# EasyEDA Pro project 封装库（F103&407通用）.epro

# Board PCB7
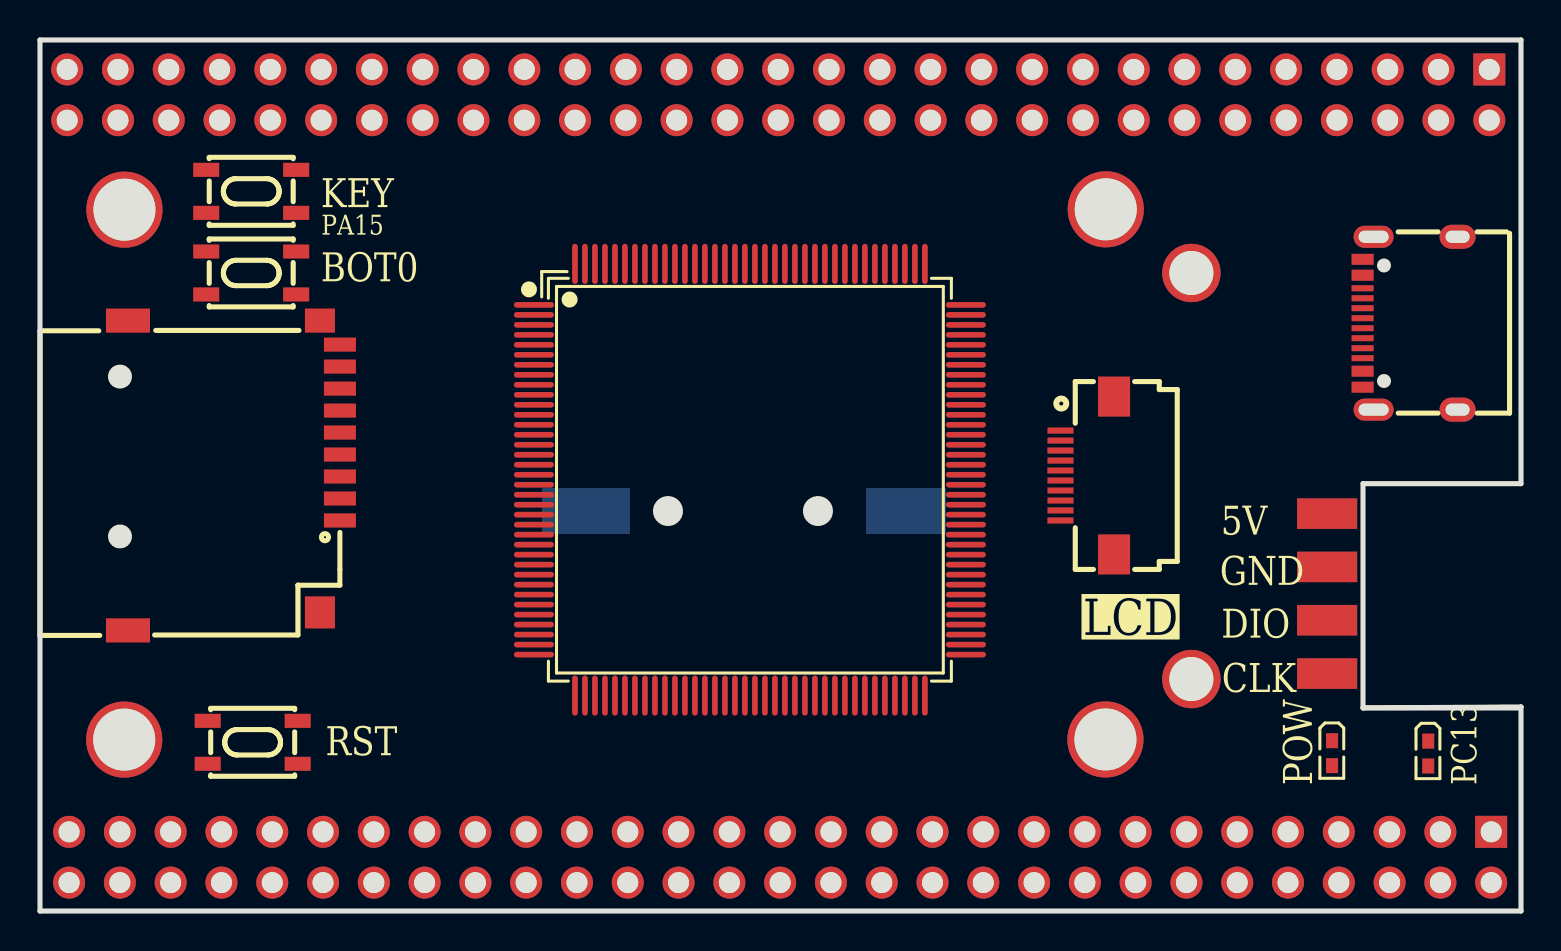
[diagram p0: board, top side]
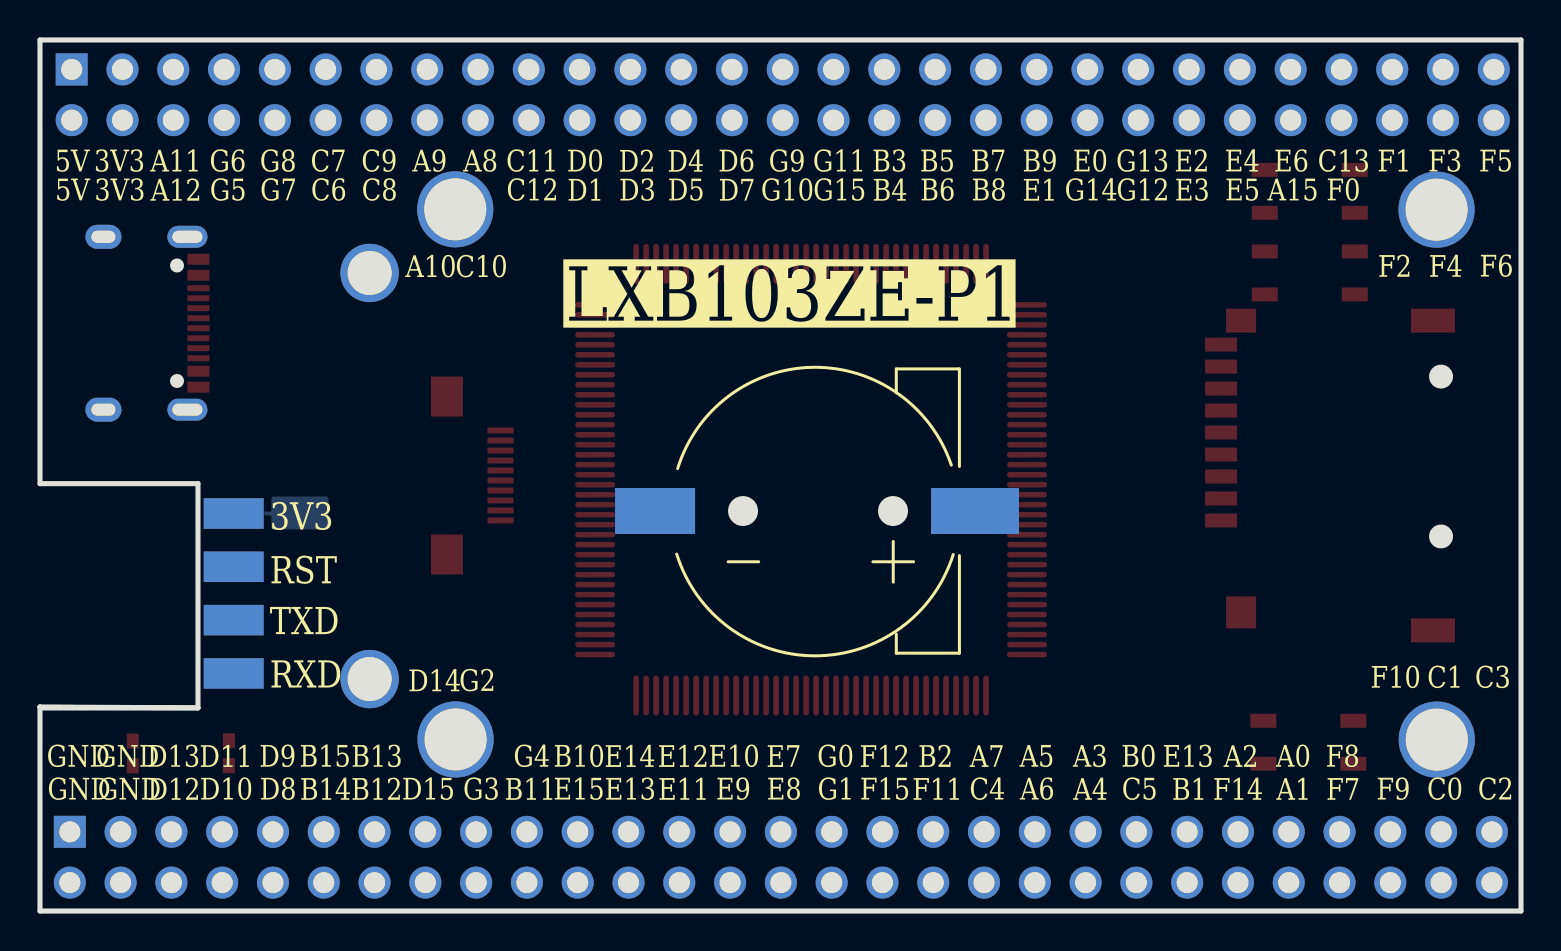
[diagram p1: board, bottom side, seen from below]

Outline 74.07 x 43.59 mm; copper layers: Top Layer, Bottom Layer. Coordinates in mm from the lower left corner of the outline.
Outline path: 66.17,10.16 66.17,21.39 74.07,21.39 74.07,43.59 0,43.59 0,0 74.07,0 74.07,10.21 ; 66.17,10.16 74.02,10.16 74.07,10.21 ; 66.17,10.16 74.07,10.21
Stack: Top Layer 0.035mm / Dielectric1 1.51mm FR4 er 4.5 / Bottom Layer 0.035mm

## Design rules (mm)
template: JLCPCB Capability(Two Layers Board)
spacing copperThickness1oz (default): track to track 0.102, other pairs 0.152 to 0.3
spacing copperThickness2oz: track to track 0.203, other pairs 0.152 to 0.3
track width copperThickness1oz (default): min 0.127, default 0.254, max 2.54
track width copperThickness2oz: min 0.203, default 0.254, max 2.54
differential pair differentialPair (default): width min 0.127, default 0.254, max 2.54; gap min 0.152, default 0.152
via viaSize (default): diameter min 0.5, default 0.61, max 10; hole min 0.3, default 0.305, max 6.3

## Placement (name value [footprint] x y rotation side)
B1  CR1220-2  [BAT-SMD_CR1220-2]  35.31 20.01 0 bottom
CARD1  TF PUSH  [TF-SMD_TF-PUSH]  9.7 21.79 270 top
FPC1  AFC01-S10FCA-00  [FPC-SMD_P0.5-10P_FGS-XJ-H2.0]  52.38 21.79 270 top
H2  X6521WV-2x29H-C60D30  [HDR-TH_58P-P2.54-V-M-R2-C29-S2.54]  37.02 2.69 180 top
H3  X6521WV-2x29H-C60D30  [HDR-TH_58P-P2.54-V-M-R2-C29-S2.54]  36.92 40.84 180 top
LED1  0603-LED-R  [LED0402]  64.62 7.9 270 top
LED2  0603-LED-G  [LED0402]  69.43 7.88 270 top
NOREF  -  [Pad_e2032]  57.58 11.61 0 top
NOREF#2  -  [Pad_e2029]  4.21 8.58 0 top
NOREF#3  -  [Pad_e2033]  57.58 31.93 0 top
NOREF#4  -  [Pad_e2030]  53.3 35.11 0 top
NOREF#5  -  [Pad_e2028]  4.22 35.09 0 top
NOREF#6  -  [Pad_e2031]  53.28 8.58 0 top
SW1  K2-1808SN-A3SW-01  [SW-SMD_4P-L4.2-W3.3-P2.15-LS5.1]  10.56 36.01 180 top
SW2  K2-1808SN-A3SW-01  [SW-SMD_4P-L4.2-W3.3-P2.15-LS5.1]  10.64 8.44 0 top
SW3  K2-1808SN-A3SW-01  [SW-SMD_4P-L4.2-W3.3-P2.15-LS5.1]  10.56 31.93 180 top
U1  STM32F103ZET6  [LQFP-144_L20.0-W20.0-P0.50-LS22.0-BL]  35.5 21.58 270 top
U5  -  [1卧式排针2.54*4P]  64.24 15.82 0 top
U6  -  [1卧式排针2.54*4P]  64.25 15.96 0 bottom
USB1  TYPE-C 16PIN 2MD(073)  [USB-C-SMD_TYPE-C-6PIN-2MD-073]  68.52 29.41 90 top

## Footprints (pads in the part's own frame, mm; a bottom-side part is the same pattern mirrored in y, then rotated)
1卧式排针2.54*4P
  rect 3x1.524 smd: 1(0.127,4.064) 2(0.127,1.397) 3(0.127,-1.27) 4(0.127,-3.937)
BAT-SMD_CR1220-2
  rect 4.4x2.3 smd: 1(-8,0)
  rect 4x2.3 smd: 2(8,0)
FPC-SMD_P0.5-10P_FGS-XJ-H2.0
  rect 0.3x1.3 smd: 1(-2.25,-1.339) 2(-1.75,-1.339) 3(-1.25,-1.34) 4(-0.75,-1.339) 5(-0.25,-1.34) 6(0.25,-1.339) 7(0.75,-1.339) 8(1.25,-1.339) 9(1.75,-1.339) 10(2.25,-1.34)
  rect 2x1.6 smd: 11(3.95,1.34) 12(-3.95,1.34)
HDR-TH_58P-P2.54-V-M-R2-C29-S2.54
  rect 1.6x1.6 hole 1.05: 1(-35.56,-1.27)
  round 1.6 hole 1.05: 2(-35.56,1.27) 3(-33.02,-1.27) 4(-33.02,1.27) 5(-30.48,-1.27) 6(-30.48,1.27) 7(-27.94,-1.27) 8(-27.94,1.27) 9(-25.4,-1.27) 10(-25.4,1.27) 11(-22.86,-1.27) 12(-22.86,1.27) 13(-20.32,-1.27) 14(-20.32,1.27) 15(-17.78,-1.27) 16(-17.78,1.27) 17(-15.24,-1.27) 18(-15.24,1.27) 19(-12.7,-1.27) 20(-12.7,1.27) 21(-10.16,-1.27) 22(-10.16,1.27) 23(-7.62,-1.27) 24(-7.62,1.27) 25(-5.08,-1.27) 26(-5.08,1.27) 27(-2.54,-1.27) 28(-2.54,1.27) 29(0,-1.27) 30(0,1.27) 31(2.54,-1.27) 32(2.54,1.27) 33(5.08,-1.27) 34(5.08,1.27) 35(7.62,-1.27) 36(7.62,1.27) 37(10.16,-1.27) 38(10.16,1.27) 39(12.7,-1.27) 40(12.7,1.27) 41(15.24,-1.27) 42(15.24,1.27) 43(17.78,-1.27) 44(17.78,1.27) 45(20.32,-1.27) 46(20.32,1.27) 47(22.86,-1.27) 48(22.86,1.27) 49(25.4,-1.27) 50(25.4,1.27) 51(27.94,-1.27) 52(27.94,1.27) 53(30.48,-1.27) 54(30.48,1.27) 55(33.02,-1.27) 56(33.02,1.27) 57(35.56,-1.27) 58(35.56,1.27)
LED0402
  rect 0.75x0.6 smd: 1(-0.623,0) 2(0.623,0)
LQFP-144_L20.0-W20.0-P0.50-LS22.0-BL
  oval 0.28x2 smd: 1(-8.75,-10.8) 2(-8.25,-10.8) 3(-7.75,-10.8) 4(-7.25,-10.8) 5(-6.75,-10.8) 6(-6.25,-10.8) 7(-5.75,-10.8) 8(-5.25,-10.8) 9(-4.75,-10.8) 10(-4.25,-10.8) 11(-3.75,-10.8) 12(-3.25,-10.8) 13(-2.75,-10.8) 14(-2.25,-10.8) 15(-1.75,-10.8) 16(-1.25,-10.8) 17(-0.75,-10.8) 18(-0.25,-10.8) 19(0.25,-10.8) 20(0.75,-10.8) 21(1.25,-10.8) 22(1.75,-10.8) 23(2.25,-10.8) 24(2.75,-10.8) 25(3.25,-10.8) 26(3.75,-10.8) 27(4.25,-10.8) 28(4.75,-10.8) 29(5.25,-10.8) 30(5.75,-10.8) 31(6.25,-10.8) 32(6.75,-10.8) 33(7.25,-10.8) 34(7.75,-10.8) 35(8.25,-10.8) 36(8.75,-10.8) 73(8.75,10.8) 74(8.25,10.8) 75(7.75,10.8) 76(7.25,10.8) 77(6.75,10.8) 78(6.25,10.8) 79(5.75,10.8) 80(5.25,10.8) 81(4.75,10.8) 82(4.25,10.8) 83(3.75,10.8) 84(3.25,10.8) 85(2.75,10.8) 86(2.25,10.8) 87(1.75,10.8) 88(1.25,10.8) 89(0.75,10.8) 90(0.25,10.8) 91(-0.25,10.8) 92(-0.75,10.8) 93(-1.25,10.8) 94(-1.75,10.8) 95(-2.25,10.8) 96(-2.75,10.8) 97(-3.25,10.8) 98(-3.75,10.8) 99(-4.25,10.8) 100(-4.75,10.8) 101(-5.25,10.8) 102(-5.75,10.8) 103(-6.25,10.8) 104(-6.75,10.8) 105(-7.25,10.8) 106(-7.75,10.8) 107(-8.25,10.8) 108(-8.75,10.8)
  oval 2x0.28 smd: 37(10.8,-8.75) 38(10.8,-8.25) 39(10.8,-7.75) 40(10.8,-7.25) 41(10.8,-6.75) 42(10.8,-6.25) 43(10.8,-5.75) 44(10.8,-5.25) 45(10.8,-4.75) 46(10.8,-4.25) 47(10.8,-3.75) 48(10.8,-3.25) 49(10.8,-2.75) 50(10.8,-2.25) 51(10.8,-1.75) 52(10.8,-1.25) 53(10.8,-0.75) 54(10.8,-0.25) 55(10.8,0.25) 56(10.8,0.75) 57(10.8,1.25) 58(10.8,1.75) 59(10.8,2.25) 60(10.8,2.75) 61(10.8,3.25) 62(10.8,3.75) 63(10.8,4.25) 64(10.8,4.75) 65(10.8,5.25) 66(10.8,5.75) 67(10.8,6.25) 68(10.8,6.75) 69(10.8,7.25) 70(10.8,7.75) 71(10.8,8.25) 72(10.8,8.75) 109(-10.8,8.75) 110(-10.8,8.25) 111(-10.8,7.75) 112(-10.8,7.25) 113(-10.8,6.75) 114(-10.8,6.25) 115(-10.8,5.75) 116(-10.8,5.25) 117(-10.8,4.75) 118(-10.8,4.25) 119(-10.8,3.75) 120(-10.8,3.25) 121(-10.8,2.75) 122(-10.8,2.25) 123(-10.8,1.75) 124(-10.8,1.25) 125(-10.8,0.75) 126(-10.8,0.25) 127(-10.8,-0.25) 128(-10.8,-0.75) 129(-10.8,-1.25) 130(-10.8,-1.75) 131(-10.8,-2.25) 132(-10.8,-2.75) 133(-10.8,-3.25) 134(-10.8,-3.75) 135(-10.8,-4.25) 136(-10.8,-4.75) 137(-10.8,-5.25) 138(-10.8,-5.75) 139(-10.8,-6.25) 140(-10.8,-6.75) 141(-10.8,-7.25) 142(-10.8,-7.75) 143(-10.8,-8.25) 144(-10.8,-8.75)
Pad_e2028
  round 3.81 hole 3.1: 1(0,0)
Pad_e2029
  round 3.81 hole 3.1: 1(0,0)
Pad_e2030
  round 3.81 hole 3.1: 1(0,0)
Pad_e2031
  round 3.81 hole 3.1: 1(0,0)
Pad_e2032
  round 2.921 hole 2.2: 1(0,0)
Pad_e2033
  round 2.921 hole 2.2: 1(0,0)
SW-SMD_4P-L4.2-W3.3-P2.15-LS5.1
  rect 1.3x0.7 smd: 1(-2.25,1.075) 2(2.25,1.075) 3(-2.25,-1.075) 4(2.25,-1.075)
TF-SMD_TF-PUSH
  rect 0.7x1.6 smd: 1(2.25,5.3) 2(1.15,5.3) 3(0.05,5.3) 4(-1.05,5.3) 5(-2.15,5.3) 6(-3.25,5.3) 7(-4.35,5.3) 8(-5.45,5.3) CD(-6.55,5.3)
  rect 1.2x1.5 smd: 10(-7.75,4.3)
  rect 1.2x2.2 smd: 11(-7.75,-5.3) 12(7.75,-5.3)
  rect 1.6x1.5 smd: 13(6.85,4.3)
USB-C-SMD_TYPE-C-6PIN-2MD-073
  rect 0.55x1.1 smd: 1(-3.2,2.375) 2(-2.4,2.375) 11(2.4,2.375) 12(3.2,2.375)
  rect 0.3x1.1 smd: 3(-1.75,2.375) 4(-1.25,2.375) 5(-0.75,2.375) 6(-0.25,2.375) 7(0.25,2.375) 8(0.75,2.375) 9(1.25,2.375) 10(1.75,2.375)
  oval 1.1x2 hole 0.6x1.5: 13(-4.325,1.825) 14(4.325,1.825)
  oval 1.2x1.8 hole 0.6x1.2: 13(-4.325,-2.375) 14(4.325,-2.375)

## Nets
3V3: CARD1.4 FPC1.9 FPC1.10 H3.3 H3.4 SW3.3 U1.17 U1.39 U1.52 U1.62 U1.72 U1.84 U1.95 U1.108 U1.121 U1.131 U1.144 U6.4
5V: H3.1 H3.2 U5.1 USB1.2 USB1.11
GND: B1.2 CARD1.6 CARD1.10 CARD1.11 CARD1.12 CARD1.13 FPC1.1 FPC1.3 FPC1.8 FPC1.11 FPC1.12 H2.1 H2.2 H2.3 H2.4 LED1.1 NOREF.1 NOREF#3.1 SW1.2 SW2.2 U1.16 U1.31 U1.38 U1.51 U1.61 U1.83 U1.94 U1.107 U1.120 U1.130 U5.2 USB1.1 USB1.12
VBAT: U1.6
VDDA: U1.32 U1.33
BOOT0: SW3.2 U1.138
BOOT1: H2.35 U1.48
IO30: U1.30
KEY_PA15: H3.50 SW1.3 U1.110
LCD_BL-PD13: FPC1.4 H2.5 U1.82
LCD_CS-PD11: FPC1.6 H2.7 U1.80
LCD_DC-PD12: FPC1.5 H2.6 U1.81
LED_PC13: H3.51 LED2.1 U1.7
OS_8M_IN: U1.23
OS_8M_OUT: U1.24
OS_32K_IN: U1.8
OS_32K_OUT: U1.9
PA0: H2.49 U1.34
PA1: H2.50 U1.35
PA2: H2.47 U1.36
PA3: H2.41 U1.37
PA4: H2.42 U1.40
PA5: H2.39 U1.41
PA6: H2.40 U1.42
PA7: H2.37 U1.43
PA8: H3.17 U1.100
PB0: H2.43 U1.46
PB1: H2.46 U1.47
PB4: H3.34 U1.134
PB6: H3.36 U1.136
PB7: H3.37 U1.137
PB8: H3.38 U1.139
PB9: H3.39 U1.140
PB10: H2.21 U1.69
PB11: H2.20 U1.70
PB12: H2.14 U1.73
PB13: H2.13 U1.74
PB14: H2.12 U1.75
PB15: H2.11 U1.76
PC0: H2.56 U1.26
PC1: H2.55 U1.27
PC2: H2.58 U1.28
PC3: H2.57 U1.29
PC4: H2.38 U1.44
PC5: H2.44 U1.45
PC6: H3.12 U1.96
PC7: H3.11 U1.97
PD0: H3.21 U1.114
PD1: H3.22 U1.115
PD3: H3.24 U1.117
PD4: H3.25 U1.118
PD5: H3.26 U1.119
PD6: H3.27 U1.122
PD7: H3.28 U1.123
PD8: H2.10 U1.77
PD9: H2.9 U1.78
PD10: H2.8 U1.79
PD14: H2.15 U1.85
PD15: H2.16 U1.86
PE0: H3.41 U1.141
PE1: H3.40 U1.142
PE2: H3.45 U1.1
PE3: H3.46 U1.2
PE4: H3.47 U1.3
PE5: H3.48 U1.4
PE6: H3.49 U1.5
PE7: H2.29 U1.58
PE8: H2.30 U1.59
PE9: H2.28 U1.60
PE10: H2.27 U1.63
PE11: H2.26 U1.64
PE12: H2.25 U1.65
PE13: H2.24 U1.66
PE14: H2.23 U1.67
PE15: H2.22 U1.68
PF0: H3.52 U1.10
PF1: H3.53 U1.11
PF2: H3.54 U1.12
PF3: H3.55 U1.13
PF4: H3.56 U1.14
PF5: H3.57 U1.15
PF6: H3.58 U1.18
PF7: H2.52 U1.19
PF8: H2.51 U1.20
PF9: H2.54 U1.21
PF10: H2.53 U1.22
PF11: H2.36 U1.49
PF12: H2.33 U1.50
PF13: H2.45 U1.53
PF14: H2.48 U1.54
PF15: H2.34 U1.55
PG0: H2.31 U1.56
PG1: H2.32 U1.57
PG2: H2.17 U1.87
PG3: H2.18 U1.88
PG4: H2.19 U1.89
PG5: H3.8 U1.90
PG6: H3.7 U1.91
PG7: H3.10 U1.92
PG8: H3.9 U1.93
PG9: H3.29 U1.124
PG10: H3.30 U1.125
PG11: H3.31 U1.126
PG12: H3.44 U1.127
PG13: H3.43 U1.128
PG14: H3.42 U1.129
PG15: H3.32 U1.132
RST: SW2.4 U1.25
SDIO_CLK_PC12: CARD1.5 H3.20 U1.113
SDIO_CMD_PD2: CARD1.3 H3.23 U1.116
SDIO_D0_PC8: CARD1.7 H3.14 U1.98
SDIO_D1_PC9: CARD1.8 H3.13 U1.99
SDIO_D2_PC10: CARD1.1 H3.18 U1.111
SDIO_D3_PC11: CARD1.2 H3.19 U1.112
SPI3_MOSI-PB5: FPC1.7 H3.35 U1.135
SPI3_SCK-PB3: FPC1.2 H3.33 U1.133
SWCLK_PA14: U1.109 U5.4
SWDIO_PA13: U1.105 U5.3
USART1-RX_PA10: H3.16 U1.102 U6.1
USART1-TX_PA9: H3.15 U1.101 U6.2
USB_D+: H3.6 U1.104 USB1.6 USB1.8
USB_D-: H3.5 U1.103 USB1.5 USB1.7
$1N3842: LED1.2
$1N4035: LED2.2
$1N6450: B1.1
$1N6781: USB1.10
$1N6784: USB1.4
$1N21871: U6.3
$1N29415: U1.71
$1N29453: U1.106
$1N29547: U1.143

Pads without a net: CARD1 CD; NOREF#2 1; NOREF#4 1; NOREF#5 1; NOREF#6 1; SW1 1 4; SW2 1 3; SW3 1 4; USB1 3 9 13 14

## Copper pours and planes (outline as drawn; the poured copper is in the pictures)
3V3 on Bottom Layer: 59.65,20.74 65.98,20.74 65.98,19.09 59.65,19.09

## Text on the board
Bottom Silkscreen Layer: LXB103ZE-P1 | F6 | F5 | C2 | C3 | F4 | F3 | C1 | C0 | F2 | F1 | F9 | F10 | F0 | F7 | F8 | C13 | A1 | A0 | E6 | A15 | E5 | E4 | A2 | F14 | E3 | E2 | B1 | E13 | C5 | B0 | G12 | G13 | A4 | E0 | A3 | G14 | B9 | E1 | A6 | A5 | B8 | B7 | A7 | C4 | B6 | B5 | B2 | F11 | B4 | B3 | F15 | F12 | G1 | G0 | G15 | G11 | G9 | E8 | E7 | G10 | D7 | D6 | E9 | E10 | D5 | D4 | E11 | E12 | D3 | D2 | E14 | D1 | D0 | E15 | B10 | G4 | C12 | C11 | B11 | A8 | G3 | G2 | C10 | A9 | D14 | A10 | D15 | C8 | C9 | B13 | B12 | C6 | C7 | B14 | B15 | G7 | G8 | D8 | D9 | G5 | G6 | D10 | D11 | A12 | A11 | D12 | D13 | GND | 3V3 | 5V | RST | TXD | RXD
Top Silkscreen Layer: PA15 | PC13 | POW | KEY | BOT0 | RST | GND | 5V | DIO | CLK | LCD
